# Altium schematic sheet Car_Wiring.SchDoc
size Tabloid
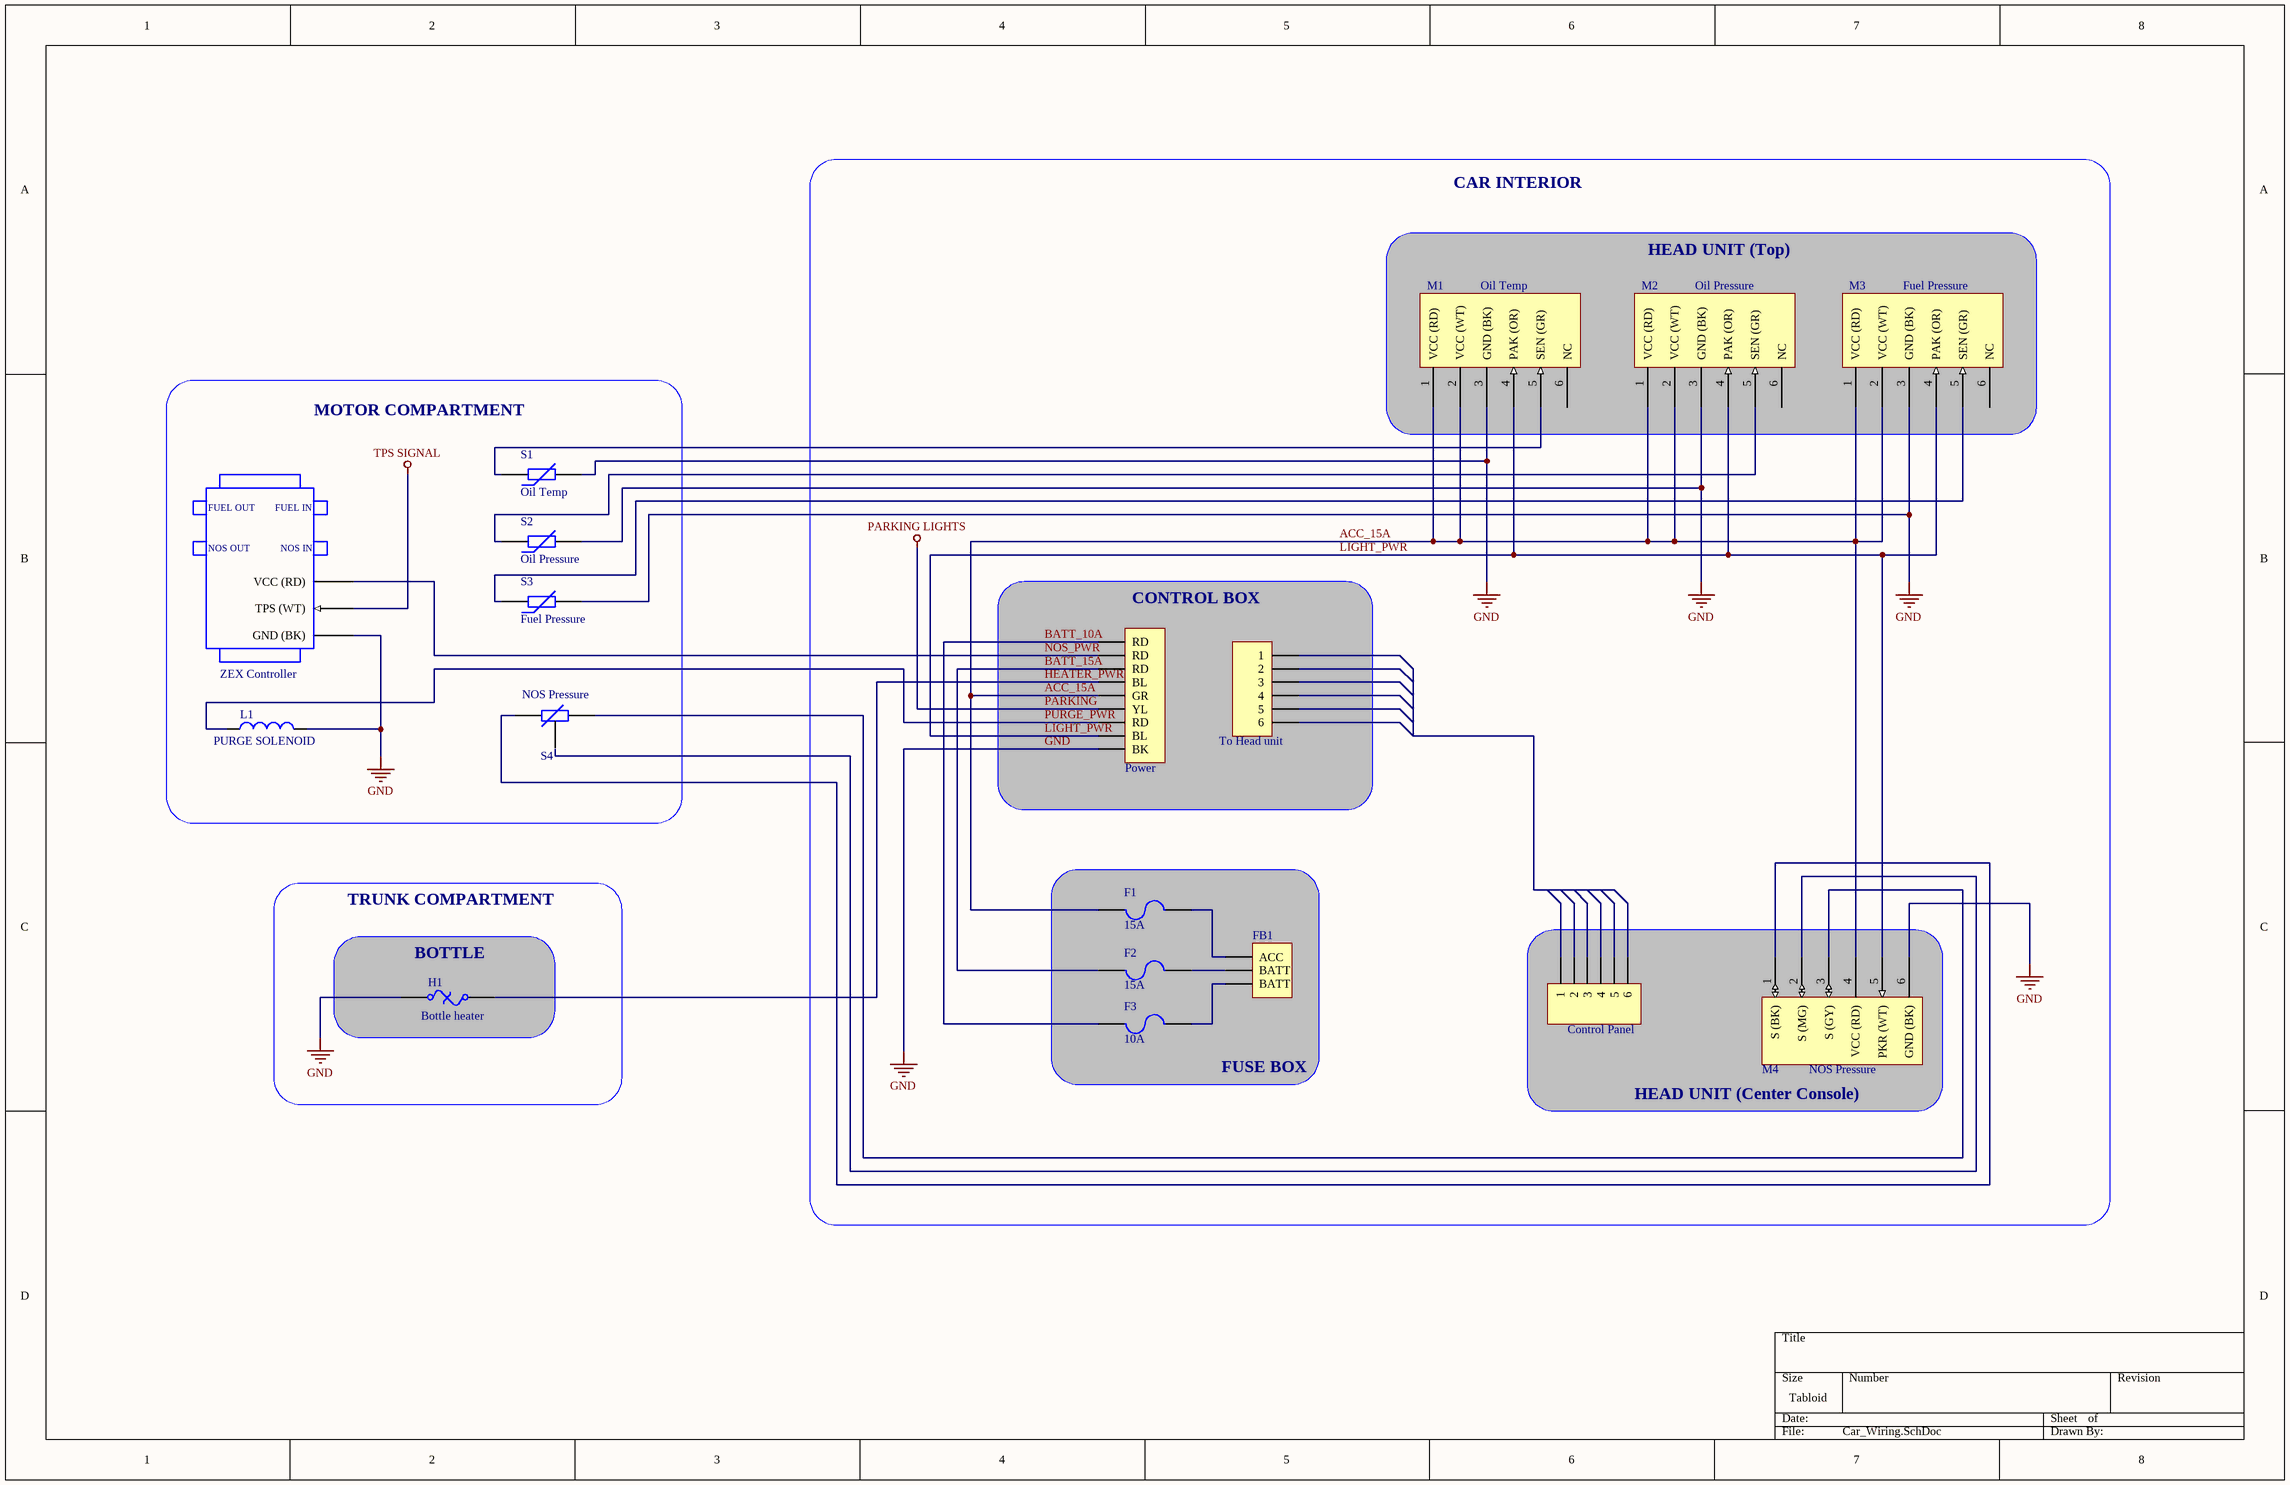
[diagram p0: Car_Wiring.SchDoc]

## Parts
(Parts that share a designator on the sheet are numbered #1, #2 ... from top to bottom, then left to right.)
?#1  Power  [MHDR1X9]
?#2  To Head unit  [MOLEX_5329_6POS_RA]
?#3  Control Panel  [MOLEX_51036_6POS]
CT1  ZEX Controller
F1  15A  [PIN-W2/E2.8]
F2  15A  [PIN-W2/E2.8]
F3  10A  [PIN-W2/E2.8]
FB1  (no value)  [MHDR1X3]
H1  Bottle heater  [PIN-W2/E2.8]
L1  PURGE SOLENOID  [0402-A]
M1  Oil Temp
M2  Oil Pressure
M3  Fuel Pressure
M4  NOS Pressure
S1  Oil Temp  [6-0805_L]
S2  Oil Pressure  [6-0805_L]
S3  Fuel Pressure  [6-0805_L]
S4  NOS Pressure

## Blocks framed on the sheet
HEAD UNIT (Top): M1-M3
MOTOR COMPARTMENT: CT1 L1 S1-S4
CONTROL BOX: ?#1 ?#2
FUSE BOX: F1-F3 FB1
BOTTLE: H1
HEAD UNIT (Center Console): ?#3 M4

## Nets
GND: ?#1.9(BK) CT1.1(GND_(BK)) H1.1 L1.2 M1.3(GND_(BK)) M2.3(GND_(BK)) M3.3(GND_(BK)) M4.6(GND_(BK)) S1.2 S2.2 S3.2
PARKING: ?#1.6(YL)  [also labelled PARKING LIGHTS]
TPS SIGNAL: CT1.2(TPS_(WT))
ACC_15A: ?#1.5(GR) F1.2 M1.1(VCC_(RD)) M1.2(VCC_(WT)) M2.1(VCC_(RD)) M2.2(VCC_(WT)) M3.1(VCC_(RD)) M3.2(VCC_(WT)) M4.4(VCC_(RD))
BATT_10A: ?#1.1(RD) F3.2
BATT_15A: ?#1.3(RD) F2.2
HEATER_PWR: ?#1.4(BL) H1.2
LIGHT_PWR: ?#1.8(BL) M1.4(PAK_(OR)) M2.4(PAK_(OR)) M3.4(PAK_(OR)) M4.5(PKR_(WT))
NOS_PWR: ?#1.2(RD) CT1.3(VCC_(RD))
PURGE_PWR: ?#1.7(RD) L1.1
NetF1_1: F1.1 FB1.1(ACC)
NetF2_1: F2.1 FB1.2(BATT)
NetF3_1: F3.1 FB1.3(BATT)
NetM1_5: M1.5(SEN_(GR)) S1.1
NetM2_5: M2.5(SEN_(GR)) S2.1
NetM3_5: M3.5(SEN_(GR)) S3.1
NetM4_1: M4.1(S_(BK)) S4.2
NetM4_3: M4.3(S_(GY)) S4.1

Not connected (* = marked no-connect by the designer): ?#2 1 2 3 4 5 6; ?#3 1 2 3 4 5 6; M1 6(NC); M2 6(NC); M3 6(NC); M4 2(S_(MG)); S4 3

## Notes on the sheet
- CAR INTERIOR
- TRUNK COMPARTMENT
- (in symbol NOS_CTRL_UNIT) FUEL OUT; FUEL IN; NOS OUT; NOS IN

## Library data of the parts
?#1 = MHDR1X9: Header, 9-Pin; LatestRevisionDate: 17-Jul-2002; LatestRevisionNote: Re-released for DXP Platform.; Publisher: Altium Limited
?#2 ?#3 = Header 6: Header, 6-Pin; LatestRevisionDate: 17-Jul-2002; LatestRevisionNote: Re-released for DXP Platform.; Publisher: Altium Limited
CT1 = NOS_CTRL_UNIT
F1-F3 = Fuse 2: Fuse; Published: 8-Jun-2000; LatestRevisionDate: 17-Jul-2002; LatestRevisionNote: Re-released for DXP Platform.; PackageReference: PIN-W2/E2.8; Publisher: Altium Limited; PackageDescription: Thru-Hole; 2 Leads
FB1 = MHDR1X3: Header, 3-Pin; LatestRevisionDate: 17-Jul-2002; LatestRevisionNote: Re-released for DXP Platform.; Publisher: Altium Limited
H1 = Fuse Thermal: Thermal Fuse; Published: 24-Mar-1999; LatestRevisionDate: 17-Jul-2002; LatestRevisionNote: Re-released for DXP Platform.; PackageReference: PIN-W2/E2.8; Publisher: Altium Limited; PackageDescription: Thru-Hole; 2 Leads
L1 = Inductor: Code_IEC: 1005; Published: 8-Jun-2000; LatestRevisionDate: 29-May-2009; LatestRevisionNote: IPC-7351 Footprint Added.; PackageReference: 0402-A; Publisher: Altium Limited; PackageDescription: Chip Inductor; Code_JEITA: 0402
M1-M3 = PS_GAUGE
M4 = AM_GAUGE
S1-S3 = Res Varistor: Varistor (Voltage-Sensitive Resistor); Published: 24-Mar-1999; LatestRevisionDate: 29-May-2009; LatestRevisionNote: IPC-7351 Footprint Added.; PackageVersion: Mar-2003; PackageReference: 6-0805; Publisher: Altium Limited; PackageDescription: Chip Resistor 0805 Case Size; Code_IPC: RESC2012
S4 = TEMP_SENSOR